# EAGLE design P10 (EAGLE 7.3.0)
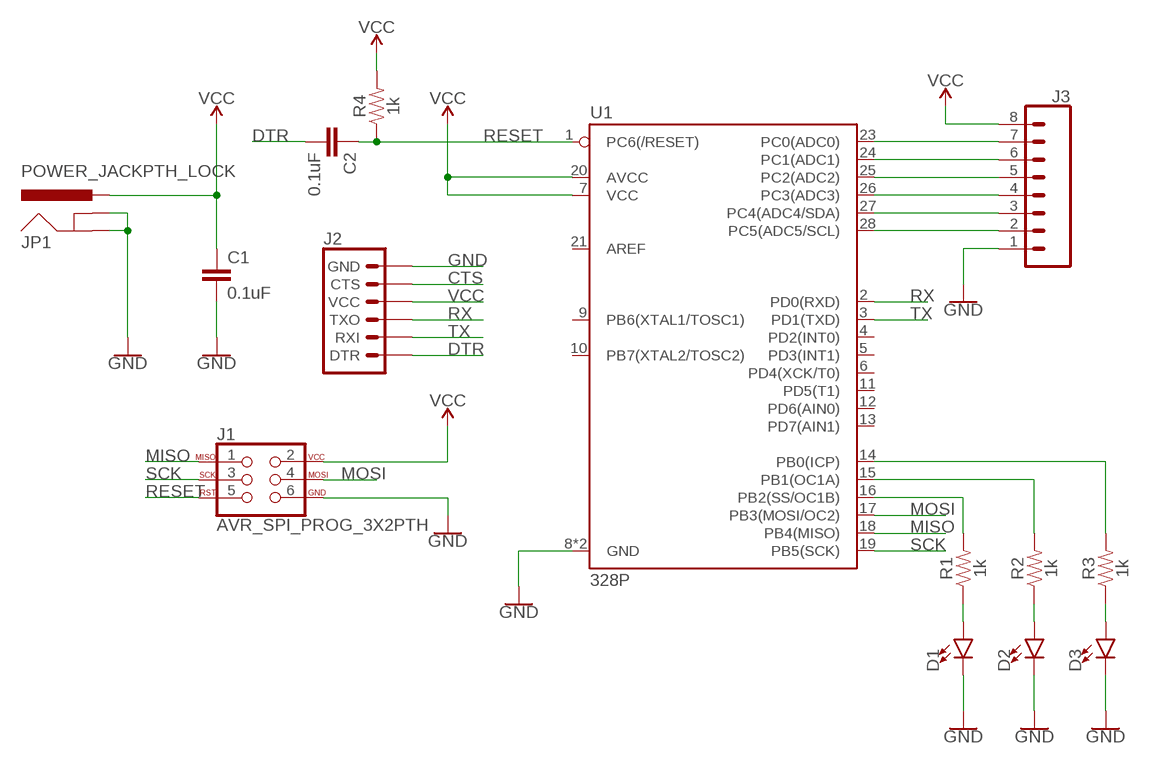
[diagram p0: schematic, sheet 1]

## Parts
C1  0.1uF  CAPPTH  [CAP-PTH-SMALL]
C2  0.1uF  CAPPTH  [CAP-PTH-SMALL]
D1  LED5MM  [LED_5MM]
D2  LED5MM  [LED_5MM]
D3  LED5MM  [LED_5MM]
J1  AVR_SPI_PROG_3X2PTH  [2X3]
J2  6_PIN_SERIAL_TARGET  [1X06]
J3  CONN_08"  [1X08]
JP1  POWER_JACKPTH_LOCK  [POWER_JACK_PTH_LOCK]
R1  1k  1KOHM-HORIZ-1/4W-1%  [AXIAL-0.3]
R2  1k  1KOHM-HORIZ-1/4W-1%  [AXIAL-0.3]
R3  1k  1KOHM-HORIZ-1/4W-1%  [AXIAL-0.3]
R4  1k  1KOHM-HORIZ-1/4W-1%  [AXIAL-0.3]
U1  328P  ATMEGA328P_PDIP  [DIP28]

## Nets
CTS: J2.5(CTS)
DTR: C2.2 J2.1(DTR)
GND: C1.2 D1.K(C) D2.K(C) D3.K(C) J1.6 J2.6(GND) J3.1 JP1.GND JP1.GNDBREAK U1.8(GND) U1.22(GND)
MISO: J1.1 U1.18(PB4(MISO))
MOSI: J1.4 U1.17(PB3(MOSI/OC2))
N$1: J3.7 U1.23(PC0(ADC0))
N$2: J3.6 U1.24(PC1(ADC1))
N$3: J3.5 U1.25(PC2(ADC2))
N$4: J3.4 U1.26(PC3(ADC3))
N$5: J3.3 U1.27(PC4(ADC4/SDA))
N$6: J3.2 U1.28(PC5(ADC5/SCL))
N$7: R1.P$2 U1.16(PB2(SS/OC1B))
N$8: R2.P$2 U1.15(PB1(OC1A))
N$9: R3.P$2 U1.14(PB0(ICP))
N$10: D1.A R1.P$1
N$11: D2.A R2.P$1
N$12: D3.A R3.P$1
RESET: C2.1 J1.5 R4.P$1 U1.1(PC6(/RESET))
RX: J2.3(TXO) U1.2(PD0(RXD))
SCK: J1.3 U1.19(PB5(SCK))
TX: J2.2(RXI) U1.3(PD1(TXD))
VCC: C1.1 J1.2 J2.4(VCC) J3.8 JP1.PWR R4.P$2 U1.7(VCC) U1.20(AVCC)
Unconnected: U1.4(PD2(INT0)) U1.5(PD3(INT1)) U1.6(PD4(XCK/T0)) U1.9(PB6(XTAL1/TOSC1)) U1.10(PB7(XTAL2/TOSC2)) U1.11(PD5(T1)) U1.12(PD6(AIN0)) U1.13(PD7(AIN1)) U1.21(AREF)

## Library data of the parts
C1 C2 = SparkFun-Capacitors:CAP: Capacitor Standard 0603 ceramic capacitor, and 0.1" leaded capacitor.
D1-D3 = SparkFun-LED:LED: LED (Generic) Standard schematic elements and footprints for 5mm, 3mm, 1206, and 0603 sized LEDs. Generic LEDs with no color specified.
J1 = SparkFun-Connectors:AVR_SPI_PROG_3X2: AVR ISP 6 Pin This is the reduced ISP connector for AVR programming. Common on Arduino. This footprint will take up less PCB space and can be used with a 10-pin to 6-pin adapter such as SKU: BOB-08508 **Special note about "TEST_POINT" package. The stop mask is on the top side, so if you want your programming test points to be on the bottom of your board, make sure to place this package on the bottom side of the board. This also ensure that the orientation to program from the bottom side will be correct. SparkFun Products: SparkFun ISP Pogo Adapter <https://www.sparkfun.com/products/11591> - NS Tiny AVR Programmer <https://www.sparkfun.com/products/11801> -PTH
J2 = SparkFun-Connectors:6_PIN_SERIAL_TARGET: 6-pin header connection for use with the "FTDI BASIC" pinout - TARGET SIDE. Also known as "Arduino Serial Program Header". It is used to mate with our FTDI Basic serial programmers using the Arduino IDE. Note, this device has "TARGET" in the name. It is intended to be used on a design that contains a target micro-controller that you wish to program. The "sister" device, named "CABLE" is inteneded to be used on a design that usually lives on the end of your USB cable and prvides the converter chip (FTDI232 or FTDI231x) to commnicate serial RX/TX. You can populate with some of these: Break Away Headers - Straight <https://www.sparkfun.com/products/116> (PRT-00116) For reference (or to suit your programming needs) check out these designs: SparkFun FTDI Basic Breakout - 5V <https://www.sparkfun.com/products/9716> (DEV-09716) SparkFun FTDI Basic Breakout - 3.3V <https://www.sparkfun.com/products/9873> (DEV-09873) SparkFun FTDI SmartBasic <https://www.sparkfun.com/products/12935> (DEV-12935) SparkFun Beefy 3 - FTDI Basic Breakout <https://www.sparkfun.com/products/13746> (DEV-13746)
J3 = SparkFun-Connectors:CONN_08: Multi connection point. Often used as Generic Header-pin footprint for 0.1 inch spaced/style header connections On any of the 0.1 inch spaced packages, you can populate with these: Break Away Headers - Straight <https://www.sparkfun.com/products/116> (PRT-00116) Break Away Male Headers - Right Angle <https://www.sparkfun.com/products/553> (PRT-00553) Female Headers <https://www.sparkfun.com/products/115> (PRT-00115) Break Away Headers - Machine Pin <https://www.sparkfun.com/products/117> (PRT-00117) Break Away Female Headers - Swiss Machine Pin <https://www.sparkfun.com/products/743> (PRT-00743) Arduino Stackable Header - 8 Pin <https://www.sparkfun.com/products/9279> (PRT-09279) For SCREWTERMINALS and SPRING TERMINALS visit here: Screw Terimnals on SparkFun.com <https://www.sparkfun.com/search/results?term=Screw+Terminals> (5mm/3.5mm/2.54mm spacing) This device is also useful as a general connection point to wire up your design to another part of your project. Our various solder wires solder well into these plated through hole pads. Hook-Up Wire - Assortment (Stranded, 22 AWG) <https://www.sparkfun.com/products/11375> (PRT-11375) Hook-Up Wire - Assortment (Solid Core, 22 AWG) <https://www.sparkfun.com/products/11367> (PRT-11367) View the entire wire category on our website here <https://www.sparkfun.com/categories/141> Special notes: Molex polarized connector foot print use with SKU : PRT-08231 with associated crimp pins and housings. 1MM SMD Version SKU: PRT-10208 NOTES ON THE VARIANTS LOCK and LOCK_LONGPADS... This footprint was designed to help hold the alignment of a through-hole component (i.e. 6-pin header) while soldering it into place. You may notice that each hole has been shifted either up or down by 0.005 of an inch from it's more standard position (which is a perfectly straight line). This slight alteration caused the pins (the squares in the middle) to touch the edges of the holes. Because they are alternating, it causes a "brace" to hold the component in place. 0.005 has proven to be the perfect amount of "off-center" position when using our standard breakaway headers. Although looks a little odd when you look at the bare footprint, once you have a header in there, the alteration is very hard to notice. Also,if you push a header all the way into place, it is covered up entirely on the bottom side.; PROD_ID: CONN-08438
JP1 = SparkFun-Connectors:POWER_JACK: Power Jack This is the standard 5.5mm barrel jack for power. The PTH is the most common, proven, reliable, footprint. The Slot footprint only works if the mill layer is transmitted to the PCB fab house so be warned. Mating wall wart : TOL-00298 (and others); PROD_ID: CONN-08197; SF_ID: PRT-00119
R1-R4 = SparkFun-Resistors:1KOHM: 1kΩ resistor A resistor is a passive two-terminal electrical component that implements electrical resistance as a circuit element. Resistors act to reduce current flow, and, at the same time, act to lower voltage levels within circuits. - Wikipedia; PROD_ID: RES-12182
U1 = SparkFun-IC-Microcontroller:ATMEGA328P_PDIP: Atmel 328P Through hole ATMEGA328P uC used in the Arduino 32kb flash, 1k EEPROM, 2k SRAM Datasheet <http://www.sparkfun.com/datasheets/Components/SMD/ATMega328.pdf> SparkFun Products Storefront component: AVR 28 Pin 20MHz 32K 6A/D - ATMega328P <https://www.sparkfun.com/products/9061> (COM-09061) SparkFun Simon Says - Through-Hole Soldering Kit <https://www.sparkfun.com/products/10547> (KIT-10547) SparkFun Learn to Solder - Simon Says <https://www.sparkfun.com/products/13708> (KIT-13708) SparkFun BigTime Watch Kit <https://www.sparkfun.com/products/11734> (KIT-11734) SparkFun ClockIt <https://www.sparkfun.com/products/10930> (KIT-10930) SparkFun Serial Enabled LCD Kit <https://www.sparkfun.com/products/10097> (LCD-10097) SparkFun Simon Tilts - Through Hole Soldering Kit <https://www.sparkfun.com/products/12634> (KIT-12634) SparkFun Frequency Counter Kit <https://www.sparkfun.com/products/10140> (KIT-10140) FabFM Radio Kit <https://www.sparkfun.com/products/11043> (KIT-11043) SparkFun Binary Blaster Kit <https://www.sparkfun.com/products/12037> (KIT-12037) SparkFun Metro-Gnome <https://www.sparkfun.com/products/9236> (KIT-09236) ATmega328 with Arduino Optiboot (Uno) <https://www.sparkfun.com/products/10524> (DEV-10524); PROD_ID: IC-09136

## Board
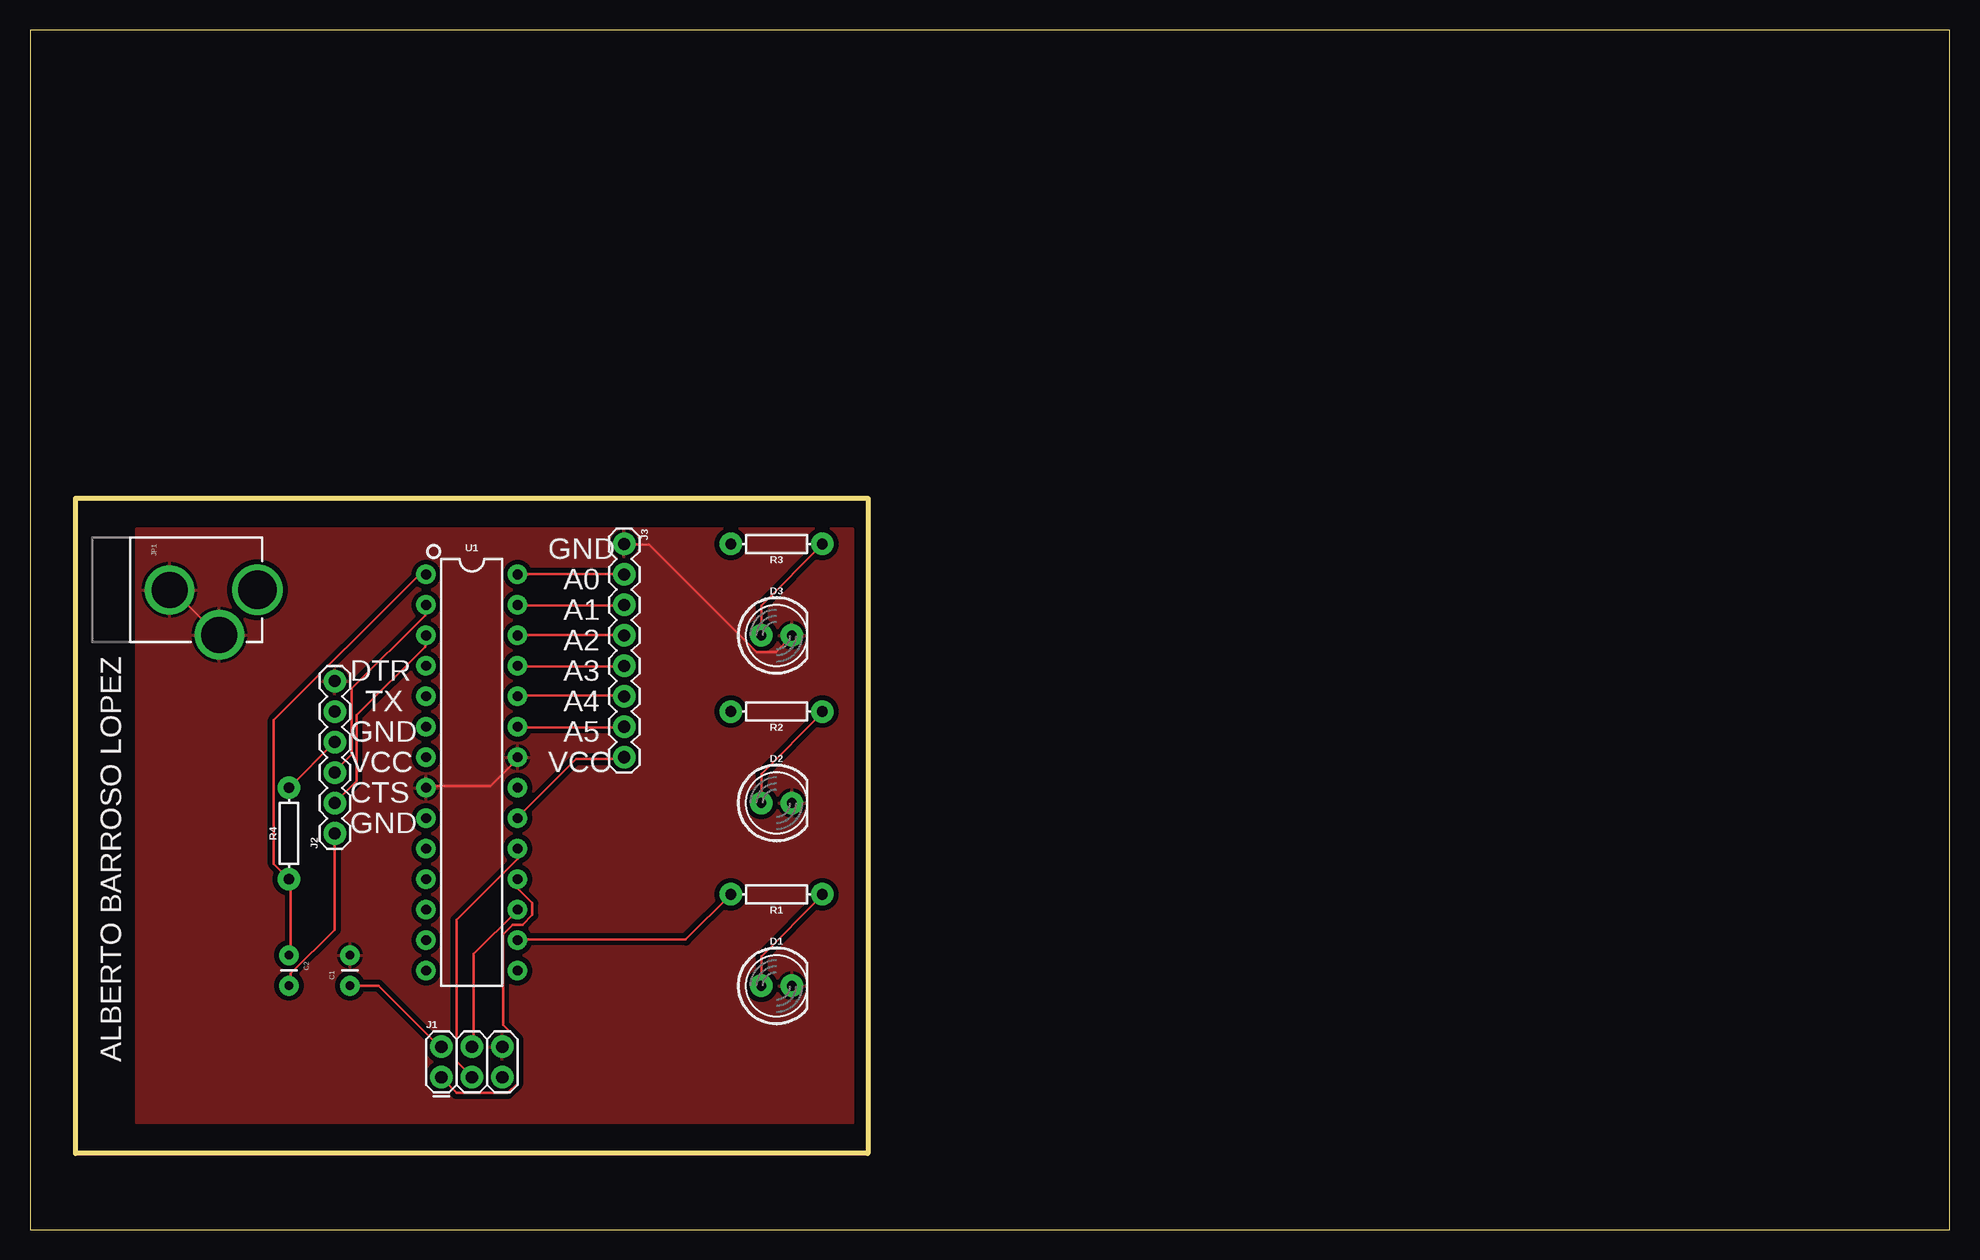
[diagram p1: board, top side]
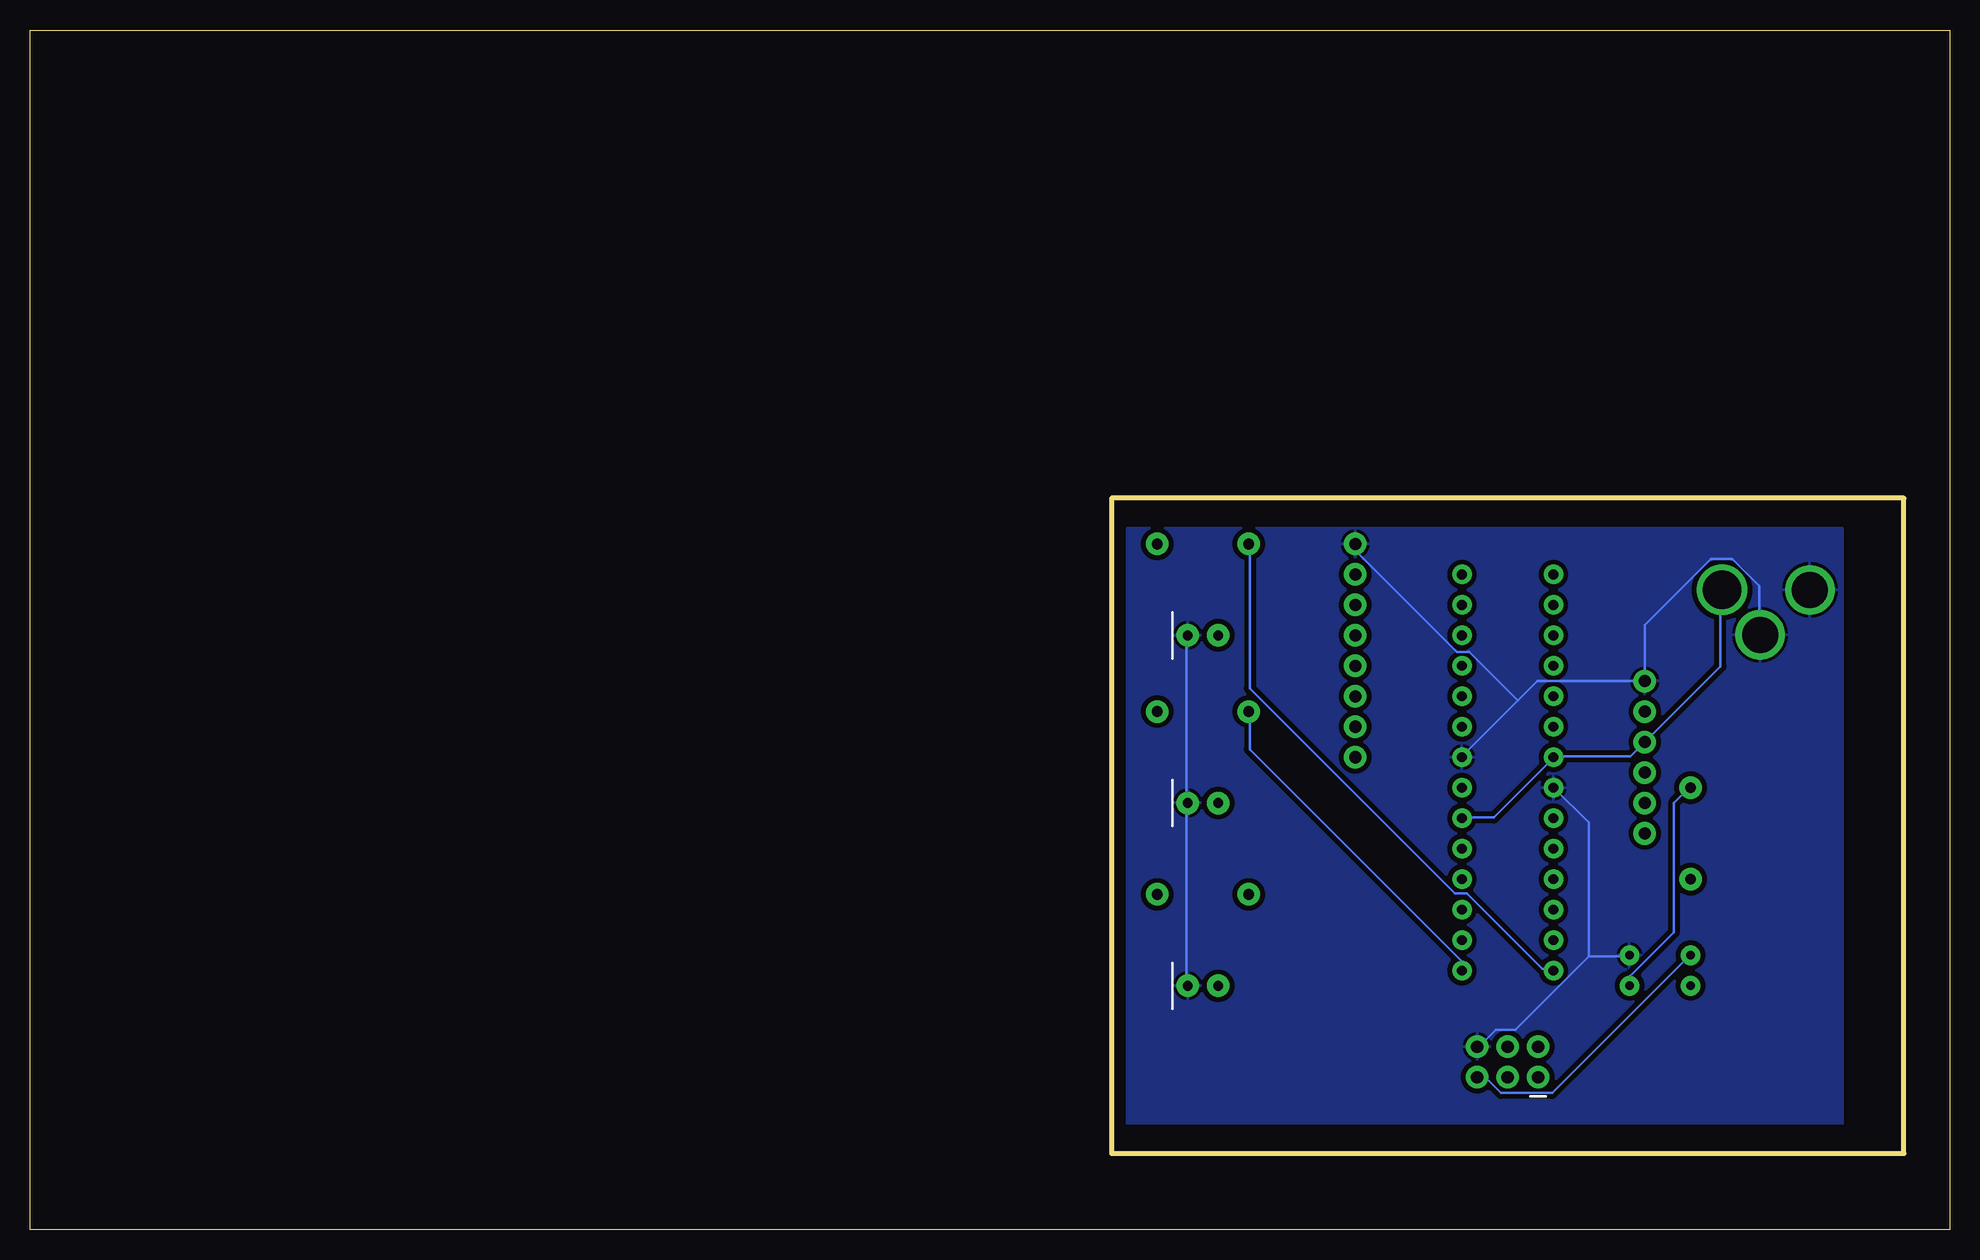
[diagram p2: board, bottom side, seen from below]

Size 160 x 100 mm. Coordinates in mm from the lower left corner, seen from the top.
Outline: 0,0 160,0 160,100 0,100 0,0
Outline: 3.81,60.96 69.85,60.96 69.85,6.35 3.81,6.35 3.81,60.96
Copper layers (1*16): Top 0.035mm / dielectric 1.5mm / Bottom 0.035mm
Design rules "SparkFun": minimum track width 8mil, minimum drill 20mil, track to track 8mil, track to pad 8mil, pad to pad 8mil, via to via 8mil, smd to smd 8mil, copper to edge 8mil, drill to drill 8mil, minimum pad ring 12mil, minimum via ring 10mil, stop-mask expansion 4mil, vias tented up to drill 20mil, thermal gap 10mil

### Footprints (pad centres in the part's own frame; a part is rotated, then mirrored left to right if it is on the bottom)
CAP-PTH-SMALL = drill 0.7 pad 1.651: 1 0,0; 2 2.54,0
LED_5MM = drill 0.813 pad 1.88: A -1.27,0; K 1.27,0
2X3 = drill 1.016 pad 1.88: 1 0,0; 2 0,2.54; 3 2.54,0; 4 2.54,2.54; 5 5.08,0; 6 5.08,2.54
1X06 = drill 1.016 pad 1.88: 1 0,0; 2 2.54,0; 3 5.08,0; 4 7.62,0; 5 10.16,0; 6 12.7,0
1X08 = drill 1.016 pad 1.88: 1 0,0; 2 2.54,0; 3 5.08,0; 4 7.62,0; 5 10.16,0; 6 12.7,0; 7 15.24,0; 8 17.78,0
POWER_JACK_PTH_LOCK = drill 2.997 pad 4.115: GND 0.025,6.557; GNDBREAK 3.762,10.7 | drill 3.2 pad 4.115: PWR 0,13.878
AXIAL-0.3 = drill 0.9 pad 1.88: P$1 -3.81,0; P$2 3.81,0
DIP28 = drill 0.813 pad 1.626: 1 -16.51,-3.81; 2 -13.97,-3.81; 3 -11.43,-3.81; 4 -8.89,-3.81; 5 -6.35,-3.81; 6 -3.81,-3.81; 7 -1.27,-3.81; 8 1.27,-3.81; 9 3.81,-3.81; 10 6.35,-3.81; 11 8.89,-3.81; 12 11.43,-3.81; 13 13.97,-3.81; 14 16.51,-3.81; 15 16.51,3.81; 16 13.97,3.81; 17 11.43,3.81; 18 8.89,3.81; 19 6.35,3.81; 20 3.81,3.81; 21 1.27,3.81; 22 -1.27,3.81; 23 -3.81,3.81; 24 -6.35,3.81; 25 -8.89,3.81; 26 -11.43,3.81; 27 -13.97,3.81; 28 -16.51,3.81

### Placement (x,y rotation side)
C1  26.67,20.32 90 top
C2  21.59,22.86 270 top
D1  62.23,20.32 0 top
D2  62.23,35.56 0 top
D3  62.23,49.53 0 top
J1  34.29,12.7 0 top
J2  25.4,33.02 90 top
J3  49.53,57.15 270 top
JP1  5.08,53.34 270 top
R1  62.23,27.94 180 top
R2  62.23,43.18 180 top
R3  62.23,57.15 180 top
R4  21.59,33.02 90 top
U1  36.83,38.1 270 top

### Tracks (layer width: path | path; a pad name or v marks a point on that pad's centre or on a via)
DTR
  Top 0.203: J2.1 25.4,24.99 21.74,21.34 21.74,20.32 C2.2
GND
  Top 0.203: J3.1 49.58,57.1 51.61,57.1 60.55,48.16 62.18,48.16 63.4,49.38 D3.K | JP1.GNDBREAK 15.65,49.58 11.79,53.44 JP1.GND | U1.8 33.12,36.98 38.41,36.98 40.64,39.22 U1.22
  Bottom 0.203: 63.6,35.56 63.6,20.32 D1.K | 63.6,35.56 63.6,49.38 D3.K | 63.6,35.56 D2.K | 30.07,22.76 26.82,22.76 C1.2 | 30.07,22.76 36.17,16.66 37.8,16.66 39.22,15.24 J1.6 | 35.97,44.09 40.64,39.42 U1.22 | 35.97,44.09 34.34,45.72 J2.6 25.4,50.39 19.91,55.88 18.09,55.88 15.85,53.65 15.85,49.58 JP1.GNDBREAK | 30.07,22.76 30.07,33.93 32.92,36.78 U1.8 | 35.97,44.09 40.03,48.16 41.05,48.16 49.38,56.49 49.38,57.1 J3.1
  pour Top (isolate 0.406): 8.89,58.42 68.58,58.42 68.58,8.89 10.16,8.89 8.89,8.89
  pour Bottom (isolate 0.406): 8.89,58.42 68.58,58.42 68.58,8.89 8.89,8.89
MISO
  Top 0.203: U1.18 40.64,28.45 41.86,27.23 41.86,26.21 41.05,25.4 40.23,25.4 39.42,24.59 39.42,17.07 40.64,15.85 40.64,12.19 39.83,11.38 35.56,11.38 34.34,12.6 J1.1
MOSI
  Top 0.203: U1.17 40.64,26.62 36.98,22.96 36.98,15.24 J1.4
N$1
  Top 0.203: U1.23 40.64,41.86 49.38,41.86 J3.7
N$2
  Top 0.203: U1.24 40.64,44.5 49.38,44.5 J3.6
N$3
  Top 0.203: U1.25 40.64,46.94 49.38,46.94 J3.5
N$4
  Top 0.203: U1.26 40.64,49.58 49.38,49.58 J3.4
N$5
  Top 0.203: U1.27 40.64,52.02 49.38,52.02 J3.3
N$6
  Top 0.203: U1.28 40.64,54.66 49.38,54.66 J3.2
N$7
  Top 0.203: R1.P$2 54.66,24.18 40.64,24.18 U1.16
N$8
  Bottom 0.203: U1.15 40.64,22.35 58.32,40.03 58.32,43.08 R2.P$2
N$9
  Bottom 0.203: U1.14 33.12,21.74 33.93,21.74 40.23,28.04 41.25,28.04 58.32,45.11 58.32,57.1 R3.P$2
N$10
  Top 0.203: D1.A 60.96,22.76 66.04,27.84 R1.P$1
N$11
  Top 0.203: D2.A 60.96,38 66.04,43.08 R2.P$1
N$12
  Top 0.203: D3.A 60.96,52.02 66.04,57.1 R3.P$1
RESET
  Top 0.203: U1.1 32.92,54.46 32.31,54.46 20.32,42.47 20.32,30.48 R4.P$1 21.74,29.06 21.74,22.96 C2.1
  Bottom 0.203: J1.5 39.22,12.6 38.61,12.6 37.39,11.38 33.12,11.38 21.74,22.76 C2.1
RX
  Top 0.203: U1.2 32.92,52.02 32.92,51.21 26.82,45.11 26.82,39.62 25.4,38.2 J2.3
SCK
  Top 0.203: U1.19 40.64,30.89 35.56,25.81 35.56,14.02 36.78,12.8 J1.3
TX
  Top 0.203: J2.2 27.23,37.39 27.23,42.88 32.92,48.56 32.92,49.38 U1.3
VCC
  Top 0.203: C1.1 29.06,20.32 34.14,15.24 J1.2 | J2.4 R4.P$2 | J3.8 49.38,39.22 45.52,39.22 40.64,34.34 U1.20
  Bottom 0.203: U1.20 40.64,34.34 38,34.34 33.12,39.22 U1.7 32.92,39.42 26.62,39.42 J2.4 19.1,46.94 19.1,53.24 JP1.PWR | C1.1 26.62,20.32 26.62,21.13 22.96,24.79 22.96,35.56 21.74,36.78 R4.P$2

### Text on the board
tPlace: GND | A0 | A1 | A2 | DTR | A3 | TX | A4 | GND | A5 | VCC | VCC | CTS | GND | ALBERTO BARROSO LOPEZ